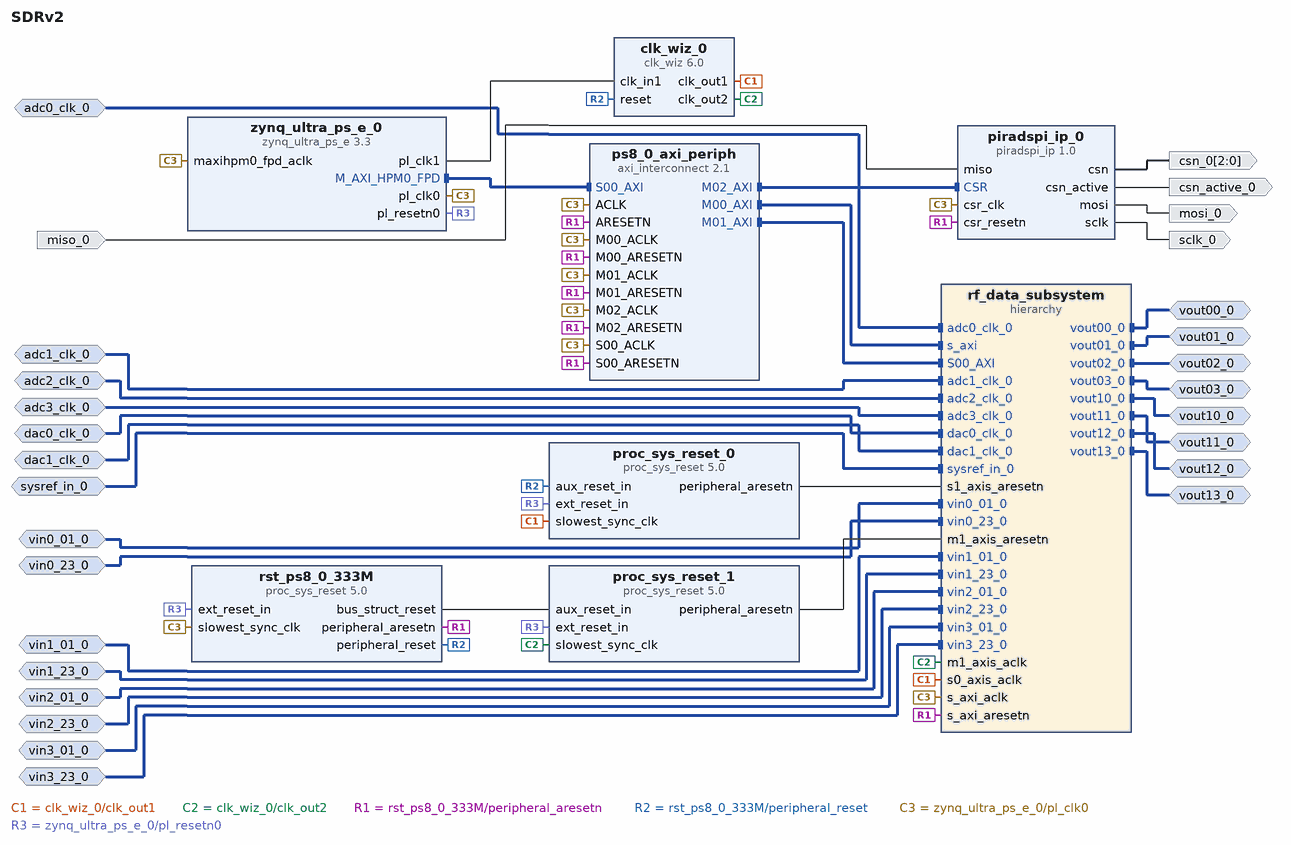
[diagram p0: block diagram of the top level]
# Vivado block design SDRv2, xczu28dr-ffvg1517-2-e, Vivado 2021.2
create_bd_design SDRv2

create_bd_intf_port -mode Slave -vlnv xilinx.com:interface:diff_clock_rtl:1.0 adc0_clk_0
create_bd_intf_port -mode Slave -vlnv xilinx.com:interface:diff_clock_rtl:1.0 adc1_clk_0
create_bd_intf_port -mode Slave -vlnv xilinx.com:interface:diff_clock_rtl:1.0 adc2_clk_0
create_bd_intf_port -mode Slave -vlnv xilinx.com:interface:diff_clock_rtl:1.0 adc3_clk_0
create_bd_intf_port -mode Slave -vlnv xilinx.com:interface:diff_clock_rtl:1.0 dac0_clk_0
create_bd_intf_port -mode Slave -vlnv xilinx.com:interface:diff_clock_rtl:1.0 dac1_clk_0
create_bd_intf_port -mode Slave -vlnv xilinx.com:display_usp_rf_data_converter:diff_pins_rtl:1.0 sysref_in_0
create_bd_intf_port -mode Slave -vlnv xilinx.com:interface:diff_analog_io_rtl:1.0 vin0_01_0
create_bd_intf_port -mode Slave -vlnv xilinx.com:interface:diff_analog_io_rtl:1.0 vin0_23_0
create_bd_intf_port -mode Slave -vlnv xilinx.com:interface:diff_analog_io_rtl:1.0 vin1_01_0
create_bd_intf_port -mode Slave -vlnv xilinx.com:interface:diff_analog_io_rtl:1.0 vin1_23_0
create_bd_intf_port -mode Slave -vlnv xilinx.com:interface:diff_analog_io_rtl:1.0 vin2_01_0
create_bd_intf_port -mode Slave -vlnv xilinx.com:interface:diff_analog_io_rtl:1.0 vin2_23_0
create_bd_intf_port -mode Slave -vlnv xilinx.com:interface:diff_analog_io_rtl:1.0 vin3_01_0
create_bd_intf_port -mode Slave -vlnv xilinx.com:interface:diff_analog_io_rtl:1.0 vin3_23_0
create_bd_intf_port -mode Master -vlnv xilinx.com:interface:diff_analog_io_rtl:1.0 vout00_0
create_bd_intf_port -mode Master -vlnv xilinx.com:interface:diff_analog_io_rtl:1.0 vout01_0
create_bd_intf_port -mode Master -vlnv xilinx.com:interface:diff_analog_io_rtl:1.0 vout02_0
create_bd_intf_port -mode Master -vlnv xilinx.com:interface:diff_analog_io_rtl:1.0 vout03_0
create_bd_intf_port -mode Master -vlnv xilinx.com:interface:diff_analog_io_rtl:1.0 vout10_0
create_bd_intf_port -mode Master -vlnv xilinx.com:interface:diff_analog_io_rtl:1.0 vout11_0
create_bd_intf_port -mode Master -vlnv xilinx.com:interface:diff_analog_io_rtl:1.0 vout12_0
create_bd_intf_port -mode Master -vlnv xilinx.com:interface:diff_analog_io_rtl:1.0 vout13_0
create_bd_port -dir O -from 2 -to 0 csn_0
create_bd_port -dir O csn_active_0
create_bd_port -dir I miso_0
create_bd_port -dir O mosi_0
create_bd_port -dir O sclk_0

create_bd_cell -type ip -vlnv xilinx.com:ip:clk_wiz:6.0 clk_wiz_0
set_property -dict [list \
  CONFIG.CLKOUT1_JITTER 75.993 \
  CONFIG.CLKOUT1_PHASE_ERROR 79.886 \
  CONFIG.CLKOUT1_REQUESTED_OUT_FREQ 400 \
  CONFIG.CLKOUT2_JITTER 72.701 \
  CONFIG.CLKOUT2_PHASE_ERROR 79.886 \
  CONFIG.CLKOUT2_REQUESTED_OUT_FREQ 500 \
  CONFIG.CLKOUT2_USED true \
  CONFIG.MMCM_CLKFBOUT_MULT_F 2.000 \
  CONFIG.MMCM_CLKOUT0_DIVIDE_F 2.500 \
  CONFIG.MMCM_CLKOUT1_DIVIDE 2 \
  CONFIG.NUM_OUT_CLKS 2 \
  CONFIG.RESET_BOARD_INTERFACE reset \
  CONFIG.USE_BOARD_FLOW true \
] [get_bd_cells clk_wiz_0]
create_bd_cell -type ip -vlnv pi-rad.io:piradip:piradspi_ip:1.0 piradspi_ip_0
create_bd_cell -type ip -vlnv xilinx.com:ip:proc_sys_reset:5.0 proc_sys_reset_0
create_bd_cell -type ip -vlnv xilinx.com:ip:proc_sys_reset:5.0 proc_sys_reset_1
create_bd_cell -type ip -vlnv xilinx.com:ip:axi_interconnect:2.1 ps8_0_axi_periph
set_property -dict {CONFIG.ENABLE_ADVANCED_OPTIONS 1 CONFIG.NUM_MI 3} [get_bd_cells ps8_0_axi_periph]
create_bd_cell -type hier rf_data_subsystem
create_bd_cell -type ip -vlnv xilinx.com:ip:proc_sys_reset:5.0 rst_ps8_0_333M
create_bd_cell -type ip -vlnv xilinx.com:ip:zynq_ultra_ps_e:3.3 zynq_ultra_ps_e_0
set_property -dict [list \
  CONFIG.PSU_BANK_0_IO_STANDARD LVCMOS18 \
  CONFIG.PSU_BANK_1_IO_STANDARD LVCMOS18 \
  CONFIG.PSU_BANK_2_IO_STANDARD LVCMOS18 \
  CONFIG.PSU_DYNAMIC_DDR_CONFIG_EN 1 \
  CONFIG.PSU_USB3__DUAL_CLOCK_ENABLE 1 \
  CONFIG.PSU__CAN1__PERIPHERAL__ENABLE 0 \
  CONFIG.PSU__CRF_APB__ACPU_CTRL__FREQMHZ 1200 \
  CONFIG.PSU__CRF_APB__ACPU_CTRL__SRCSEL APLL \
  CONFIG.PSU__CRF_APB__APLL_CTRL__SRCSEL PSS_REF_CLK \
  CONFIG.PSU__CRF_APB__DBG_FPD_CTRL__FREQMHZ 250 \
  CONFIG.PSU__CRF_APB__DBG_FPD_CTRL__SRCSEL IOPLL \
  CONFIG.PSU__CRF_APB__DBG_TRACE_CTRL__FREQMHZ 250 \
  CONFIG.PSU__CRF_APB__DBG_TRACE_CTRL__SRCSEL IOPLL \
  CONFIG.PSU__CRF_APB__DBG_TSTMP_CTRL__FREQMHZ 250 \
  CONFIG.PSU__CRF_APB__DBG_TSTMP_CTRL__SRCSEL IOPLL \
  CONFIG.PSU__CRF_APB__DDR_CTRL__FREQMHZ 1067 \
  CONFIG.PSU__CRF_APB__DDR_CTRL__SRCSEL DPLL \
  CONFIG.PSU__CRF_APB__DPDMA_REF_CTRL__FREQMHZ 600 \
  CONFIG.PSU__CRF_APB__DPDMA_REF_CTRL__SRCSEL APLL \
  CONFIG.PSU__CRF_APB__DPLL_CTRL__SRCSEL PSS_REF_CLK \
  CONFIG.PSU__CRF_APB__DP_AUDIO_REF_CTRL__SRCSEL RPLL \
  CONFIG.PSU__CRF_APB__DP_STC_REF_CTRL__SRCSEL RPLL \
  CONFIG.PSU__CRF_APB__DP_VIDEO_REF_CTRL__SRCSEL VPLL \
  CONFIG.PSU__CRF_APB__GDMA_REF_CTRL__FREQMHZ 600 \
  CONFIG.PSU__CRF_APB__GDMA_REF_CTRL__SRCSEL APLL \
  CONFIG.PSU__CRF_APB__GPU_REF_CTRL__FREQMHZ 500 \
  CONFIG.PSU__CRF_APB__GPU_REF_CTRL__SRCSEL IOPLL \
  CONFIG.PSU__CRF_APB__TOPSW_LSBUS_CTRL__FREQMHZ 100 \
  CONFIG.PSU__CRF_APB__TOPSW_LSBUS_CTRL__SRCSEL IOPLL \
  CONFIG.PSU__CRF_APB__TOPSW_MAIN_CTRL__FREQMHZ 533.33 \
  CONFIG.PSU__CRF_APB__TOPSW_MAIN_CTRL__SRCSEL DPLL \
  CONFIG.PSU__CRF_APB__VPLL_CTRL__SRCSEL PSS_REF_CLK \
  CONFIG.PSU__CRL_APB__ADMA_REF_CTRL__FREQMHZ 500 \
  CONFIG.PSU__CRL_APB__ADMA_REF_CTRL__SRCSEL IOPLL \
  CONFIG.PSU__CRL_APB__CAN1_REF_CTRL__FREQMHZ 100 \
  CONFIG.PSU__CRL_APB__CAN1_REF_CTRL__SRCSEL IOPLL \
  CONFIG.PSU__CRL_APB__CPU_R5_CTRL__FREQMHZ 500 \
  CONFIG.PSU__CRL_APB__CPU_R5_CTRL__SRCSEL IOPLL \
  CONFIG.PSU__CRL_APB__DBG_LPD_CTRL__FREQMHZ 250 \
  CONFIG.PSU__CRL_APB__DBG_LPD_CTRL__SRCSEL IOPLL \
  CONFIG.PSU__CRL_APB__GEM3_REF_CTRL__FREQMHZ 125 \
  CONFIG.PSU__CRL_APB__GEM3_REF_CTRL__SRCSEL IOPLL \
  CONFIG.PSU__CRL_APB__I2C0_REF_CTRL__FREQMHZ 100 \
  CONFIG.PSU__CRL_APB__I2C0_REF_CTRL__SRCSEL IOPLL \
  CONFIG.PSU__CRL_APB__I2C1_REF_CTRL__FREQMHZ 100 \
  CONFIG.PSU__CRL_APB__I2C1_REF_CTRL__SRCSEL IOPLL \
  CONFIG.PSU__CRL_APB__IOPLL_CTRL__SRCSEL PSS_REF_CLK \
  CONFIG.PSU__CRL_APB__IOU_SWITCH_CTRL__FREQMHZ 250 \
  CONFIG.PSU__CRL_APB__IOU_SWITCH_CTRL__SRCSEL IOPLL \
  CONFIG.PSU__CRL_APB__LPD_LSBUS_CTRL__FREQMHZ 100 \
  CONFIG.PSU__CRL_APB__LPD_LSBUS_CTRL__SRCSEL IOPLL \
  CONFIG.PSU__CRL_APB__LPD_SWITCH_CTRL__FREQMHZ 500 \
  CONFIG.PSU__CRL_APB__LPD_SWITCH_CTRL__SRCSEL IOPLL \
  CONFIG.PSU__CRL_APB__PCAP_CTRL__FREQMHZ 200 \
  CONFIG.PSU__CRL_APB__PCAP_CTRL__SRCSEL IOPLL \
  CONFIG.PSU__CRL_APB__PL0_REF_CTRL__FREQMHZ 333.333 \
  CONFIG.PSU__CRL_APB__PL0_REF_CTRL__SRCSEL RPLL \
  CONFIG.PSU__CRL_APB__PL1_REF_CTRL__FREQMHZ 500 \
  CONFIG.PSU__CRL_APB__QSPI_REF_CTRL__FREQMHZ 125 \
  CONFIG.PSU__CRL_APB__QSPI_REF_CTRL__SRCSEL IOPLL \
  CONFIG.PSU__CRL_APB__RPLL_CTRL__SRCSEL PSS_REF_CLK \
  CONFIG.PSU__CRL_APB__SDIO1_REF_CTRL__FREQMHZ 200 \
  CONFIG.PSU__CRL_APB__SDIO1_REF_CTRL__SRCSEL IOPLL \
  CONFIG.PSU__CRL_APB__TIMESTAMP_REF_CTRL__FREQMHZ 100 \
  CONFIG.PSU__CRL_APB__TIMESTAMP_REF_CTRL__SRCSEL IOPLL \
  CONFIG.PSU__CRL_APB__UART0_REF_CTRL__FREQMHZ 100 \
  CONFIG.PSU__CRL_APB__UART0_REF_CTRL__SRCSEL IOPLL \
  CONFIG.PSU__CRL_APB__UART1_REF_CTRL__FREQMHZ 100 \
  CONFIG.PSU__CRL_APB__UART1_REF_CTRL__SRCSEL IOPLL \
  CONFIG.PSU__CRL_APB__USB0_BUS_REF_CTRL__FREQMHZ 250 \
  CONFIG.PSU__CRL_APB__USB0_BUS_REF_CTRL__SRCSEL IOPLL \
  CONFIG.PSU__CRL_APB__USB3_DUAL_REF_CTRL__FREQMHZ 20 \
  CONFIG.PSU__CRL_APB__USB3_DUAL_REF_CTRL__SRCSEL IOPLL \
  CONFIG.PSU__CRL_APB__USB3__ENABLE 1 \
  CONFIG.PSU__CSUPMU__PERIPHERAL__VALID 1 \
  CONFIG.PSU__DDRC__BUS_WIDTH {64 Bit} \
  CONFIG.PSU__DDRC__COMPONENTS UDIMM \
  CONFIG.PSU__DDRC__DEVICE_CAPACITY {8192 MBits} \
  CONFIG.PSU__DDRC__DRAM_WIDTH {16 Bits} \
  CONFIG.PSU__DDRC__ECC Disabled \
  CONFIG.PSU__DDRC__MEMORY_TYPE {DDR 4} \
  CONFIG.PSU__DDRC__SPEED_BIN DDR4_2133P \
  CONFIG.PSU__DDR_HIGH_ADDRESS_GUI_ENABLE 1 \
  CONFIG.PSU__DDR__INTERFACE__FREQMHZ 533.500 \
  CONFIG.PSU__DISPLAYPORT__LANE0__ENABLE 1 \
  CONFIG.PSU__DISPLAYPORT__LANE0__IO {GT Lane1} \
  CONFIG.PSU__DISPLAYPORT__LANE1__ENABLE 1 \
  CONFIG.PSU__DISPLAYPORT__LANE1__IO {GT Lane0} \
  CONFIG.PSU__DISPLAYPORT__PERIPHERAL__ENABLE 1 \
  CONFIG.PSU__DLL__ISUSED 1 \
  CONFIG.PSU__DPAUX__PERIPHERAL__ENABLE 1 \
  CONFIG.PSU__DPAUX__PERIPHERAL__IO {MIO 27 .. 30} \
  CONFIG.PSU__DP__LANE_SEL {Dual Lower} \
  CONFIG.PSU__DP__REF_CLK_FREQ 27 \
  CONFIG.PSU__DP__REF_CLK_SEL {Ref Clk1} \
  CONFIG.PSU__ENET3__FIFO__ENABLE 0 \
  CONFIG.PSU__ENET3__GRP_MDIO__ENABLE 1 \
  CONFIG.PSU__ENET3__GRP_MDIO__IO {MIO 76 .. 77} \
  CONFIG.PSU__ENET3__PERIPHERAL__ENABLE 1 \
  CONFIG.PSU__ENET3__PERIPHERAL__IO {MIO 64 .. 75} \
  CONFIG.PSU__ENET3__PTP__ENABLE 0 \
  CONFIG.PSU__ENET3__TSU__ENABLE 0 \
  CONFIG.PSU__FPGA_PL0_ENABLE 1 \
  CONFIG.PSU__FPGA_PL1_ENABLE 1 \
  CONFIG.PSU__GEM3_COHERENCY 0 \
  CONFIG.PSU__GEM3_ROUTE_THROUGH_FPD 0 \
  CONFIG.PSU__GEM__TSU__ENABLE 0 \
  CONFIG.PSU__GPIO0_MIO__IO {MIO 0 .. 25} \
  CONFIG.PSU__GPIO0_MIO__PERIPHERAL__ENABLE 1 \
  CONFIG.PSU__GPIO1_MIO__IO {MIO 26 .. 51} \
  CONFIG.PSU__GPIO1_MIO__PERIPHERAL__ENABLE 1 \
  CONFIG.PSU__GT__LINK_SPEED HBR \
  CONFIG.PSU__GT__PRE_EMPH_LVL_4 0 \
  CONFIG.PSU__GT__VLT_SWNG_LVL_4 0 \
  CONFIG.PSU__I2C0__PERIPHERAL__ENABLE 1 \
  CONFIG.PSU__I2C0__PERIPHERAL__IO {MIO 14 .. 15} \
  CONFIG.PSU__I2C1__PERIPHERAL__ENABLE 1 \
  CONFIG.PSU__I2C1__PERIPHERAL__IO {MIO 16 .. 17} \
  CONFIG.PSU__IOU_SLCR__IOU_TTC_APB_CLK__TTC0_SEL APB \
  CONFIG.PSU__IOU_SLCR__IOU_TTC_APB_CLK__TTC1_SEL APB \
  CONFIG.PSU__IOU_SLCR__IOU_TTC_APB_CLK__TTC2_SEL APB \
  CONFIG.PSU__IOU_SLCR__IOU_TTC_APB_CLK__TTC3_SEL APB \
  CONFIG.PSU__MAXIGP0__DATA_WIDTH 128 \
  CONFIG.PSU__OVERRIDE__BASIC_CLOCK 0 \
  CONFIG.PSU__PMU_COHERENCY 0 \
  CONFIG.PSU__PMU__AIBACK__ENABLE 0 \
  CONFIG.PSU__PMU__EMIO_GPI__ENABLE 0 \
  CONFIG.PSU__PMU__EMIO_GPO__ENABLE 0 \
  CONFIG.PSU__PMU__GPI0__ENABLE 0 \
  CONFIG.PSU__PMU__GPI1__ENABLE 0 \
  CONFIG.PSU__PMU__GPI2__ENABLE 0 \
  CONFIG.PSU__PMU__GPI3__ENABLE 0 \
  CONFIG.PSU__PMU__GPI4__ENABLE 0 \
  CONFIG.PSU__PMU__GPI5__ENABLE 0 \
  CONFIG.PSU__PMU__GPO0__ENABLE 1 \
  CONFIG.PSU__PMU__GPO0__IO {MIO 32} \
  CONFIG.PSU__PMU__GPO1__ENABLE 1 \
  CONFIG.PSU__PMU__GPO1__IO {MIO 33} \
  CONFIG.PSU__PMU__GPO2__ENABLE 1 \
  CONFIG.PSU__PMU__GPO2__IO {MIO 34} \
  CONFIG.PSU__PMU__GPO2__POLARITY low \
  CONFIG.PSU__PMU__GPO3__ENABLE 1 \
  CONFIG.PSU__PMU__GPO3__IO {MIO 35} \
  CONFIG.PSU__PMU__GPO3__POLARITY low \
  CONFIG.PSU__PMU__GPO4__ENABLE 1 \
  CONFIG.PSU__PMU__GPO4__IO {MIO 36} \
  CONFIG.PSU__PMU__GPO4__POLARITY low \
  CONFIG.PSU__PMU__GPO5__ENABLE 1 \
  CONFIG.PSU__PMU__GPO5__IO {MIO 37} \
  CONFIG.PSU__PMU__GPO5__POLARITY low \
  CONFIG.PSU__PMU__PERIPHERAL__ENABLE 1 \
  CONFIG.PSU__PMU__PLERROR__ENABLE 0 \
  CONFIG.PSU__PRESET_APPLIED 1 \
  CONFIG.PSU__PSS_REF_CLK__FREQMHZ 33.333 \
  CONFIG.PSU__QSPI_COHERENCY 0 \
  CONFIG.PSU__QSPI_ROUTE_THROUGH_FPD 0 \
  CONFIG.PSU__QSPI__GRP_FBCLK__ENABLE 1 \
  CONFIG.PSU__QSPI__GRP_FBCLK__IO {MIO 6} \
  CONFIG.PSU__QSPI__PERIPHERAL__DATA_MODE x4 \
  CONFIG.PSU__QSPI__PERIPHERAL__ENABLE 1 \
  CONFIG.PSU__QSPI__PERIPHERAL__IO {MIO 0 .. 12} \
  CONFIG.PSU__QSPI__PERIPHERAL__MODE {Dual Parallel} \
  CONFIG.PSU__SATA__LANE1__IO {GT Lane3} \
  CONFIG.PSU__SATA__PERIPHERAL__ENABLE 1 \
  CONFIG.PSU__SATA__REF_CLK_FREQ 125 \
  CONFIG.PSU__SATA__REF_CLK_SEL {Ref Clk3} \
  CONFIG.PSU__SD1_COHERENCY 0 \
  CONFIG.PSU__SD1_ROUTE_THROUGH_FPD 0 \
  CONFIG.PSU__SD1__DATA_TRANSFER_MODE 8Bit \
  CONFIG.PSU__SD1__GRP_CD__ENABLE 1 \
  CONFIG.PSU__SD1__GRP_CD__IO {MIO 45} \
  CONFIG.PSU__SD1__GRP_POW__ENABLE 0 \
  CONFIG.PSU__SD1__GRP_WP__ENABLE 0 \
  CONFIG.PSU__SD1__PERIPHERAL__ENABLE 1 \
  CONFIG.PSU__SD1__PERIPHERAL__IO {MIO 39 .. 51} \
  CONFIG.PSU__SD1__SLOT_TYPE {SD 3.0} \
  CONFIG.PSU__SWDT0__CLOCK__ENABLE 0 \
  CONFIG.PSU__SWDT0__PERIPHERAL__ENABLE 1 \
  CONFIG.PSU__SWDT0__RESET__ENABLE 0 \
  CONFIG.PSU__SWDT1__CLOCK__ENABLE 0 \
  CONFIG.PSU__SWDT1__PERIPHERAL__ENABLE 1 \
  CONFIG.PSU__SWDT1__RESET__ENABLE 0 \
  CONFIG.PSU__TSU__BUFG_PORT_PAIR 0 \
  CONFIG.PSU__TTC0__CLOCK__ENABLE 0 \
  CONFIG.PSU__TTC0__PERIPHERAL__ENABLE 1 \
  CONFIG.PSU__TTC0__WAVEOUT__ENABLE 0 \
  CONFIG.PSU__TTC1__CLOCK__ENABLE 0 \
  CONFIG.PSU__TTC1__PERIPHERAL__ENABLE 1 \
  CONFIG.PSU__TTC1__WAVEOUT__ENABLE 0 \
  CONFIG.PSU__TTC2__CLOCK__ENABLE 0 \
  CONFIG.PSU__TTC2__PERIPHERAL__ENABLE 1 \
  CONFIG.PSU__TTC2__WAVEOUT__ENABLE 0 \
  CONFIG.PSU__TTC3__CLOCK__ENABLE 0 \
  CONFIG.PSU__TTC3__PERIPHERAL__ENABLE 1 \
  CONFIG.PSU__TTC3__WAVEOUT__ENABLE 0 \
  CONFIG.PSU__UART0__BAUD_RATE 115200 \
  CONFIG.PSU__UART0__MODEM__ENABLE 0 \
  CONFIG.PSU__UART0__PERIPHERAL__ENABLE 1 \
  CONFIG.PSU__UART0__PERIPHERAL__IO {MIO 18 .. 19} \
  CONFIG.PSU__UART1__BAUD_RATE 115200 \
  CONFIG.PSU__UART1__MODEM__ENABLE 0 \
  CONFIG.PSU__UART1__PERIPHERAL__ENABLE 1 \
  CONFIG.PSU__UART1__PERIPHERAL__IO EMIO \
  CONFIG.PSU__USB0_COHERENCY 0 \
  CONFIG.PSU__USB0__PERIPHERAL__ENABLE 1 \
  CONFIG.PSU__USB0__PERIPHERAL__IO {MIO 52 .. 63} \
  CONFIG.PSU__USB0__REF_CLK_FREQ 26 \
  CONFIG.PSU__USB0__REF_CLK_SEL {Ref Clk2} \
  CONFIG.PSU__USB2_0__EMIO__ENABLE 0 \
  CONFIG.PSU__USB3_0__EMIO__ENABLE 0 \
  CONFIG.PSU__USB3_0__PERIPHERAL__ENABLE 1 \
  CONFIG.PSU__USB3_0__PERIPHERAL__IO {GT Lane2} \
  CONFIG.PSU__USB__RESET__MODE {Boot Pin} \
  CONFIG.PSU__USB__RESET__POLARITY {Active Low} \
  CONFIG.PSU__USE__IRQ0 1 \
  CONFIG.PSU__USE__M_AXI_GP0 1 \
  CONFIG.PSU__USE__M_AXI_GP1 0 \
  CONFIG.PSU__USE__M_AXI_GP2 0 \
] [get_bd_cells zynq_ultra_ps_e_0]
# 102 more settings of zynq_ultra_ps_e_0 are not shown: defaults, MIO pin electricals, DDR timing, and values the tool derives

# ---- hierarchy /rf_data_subsystem ----
current_bd_instance /rf_data_subsystem
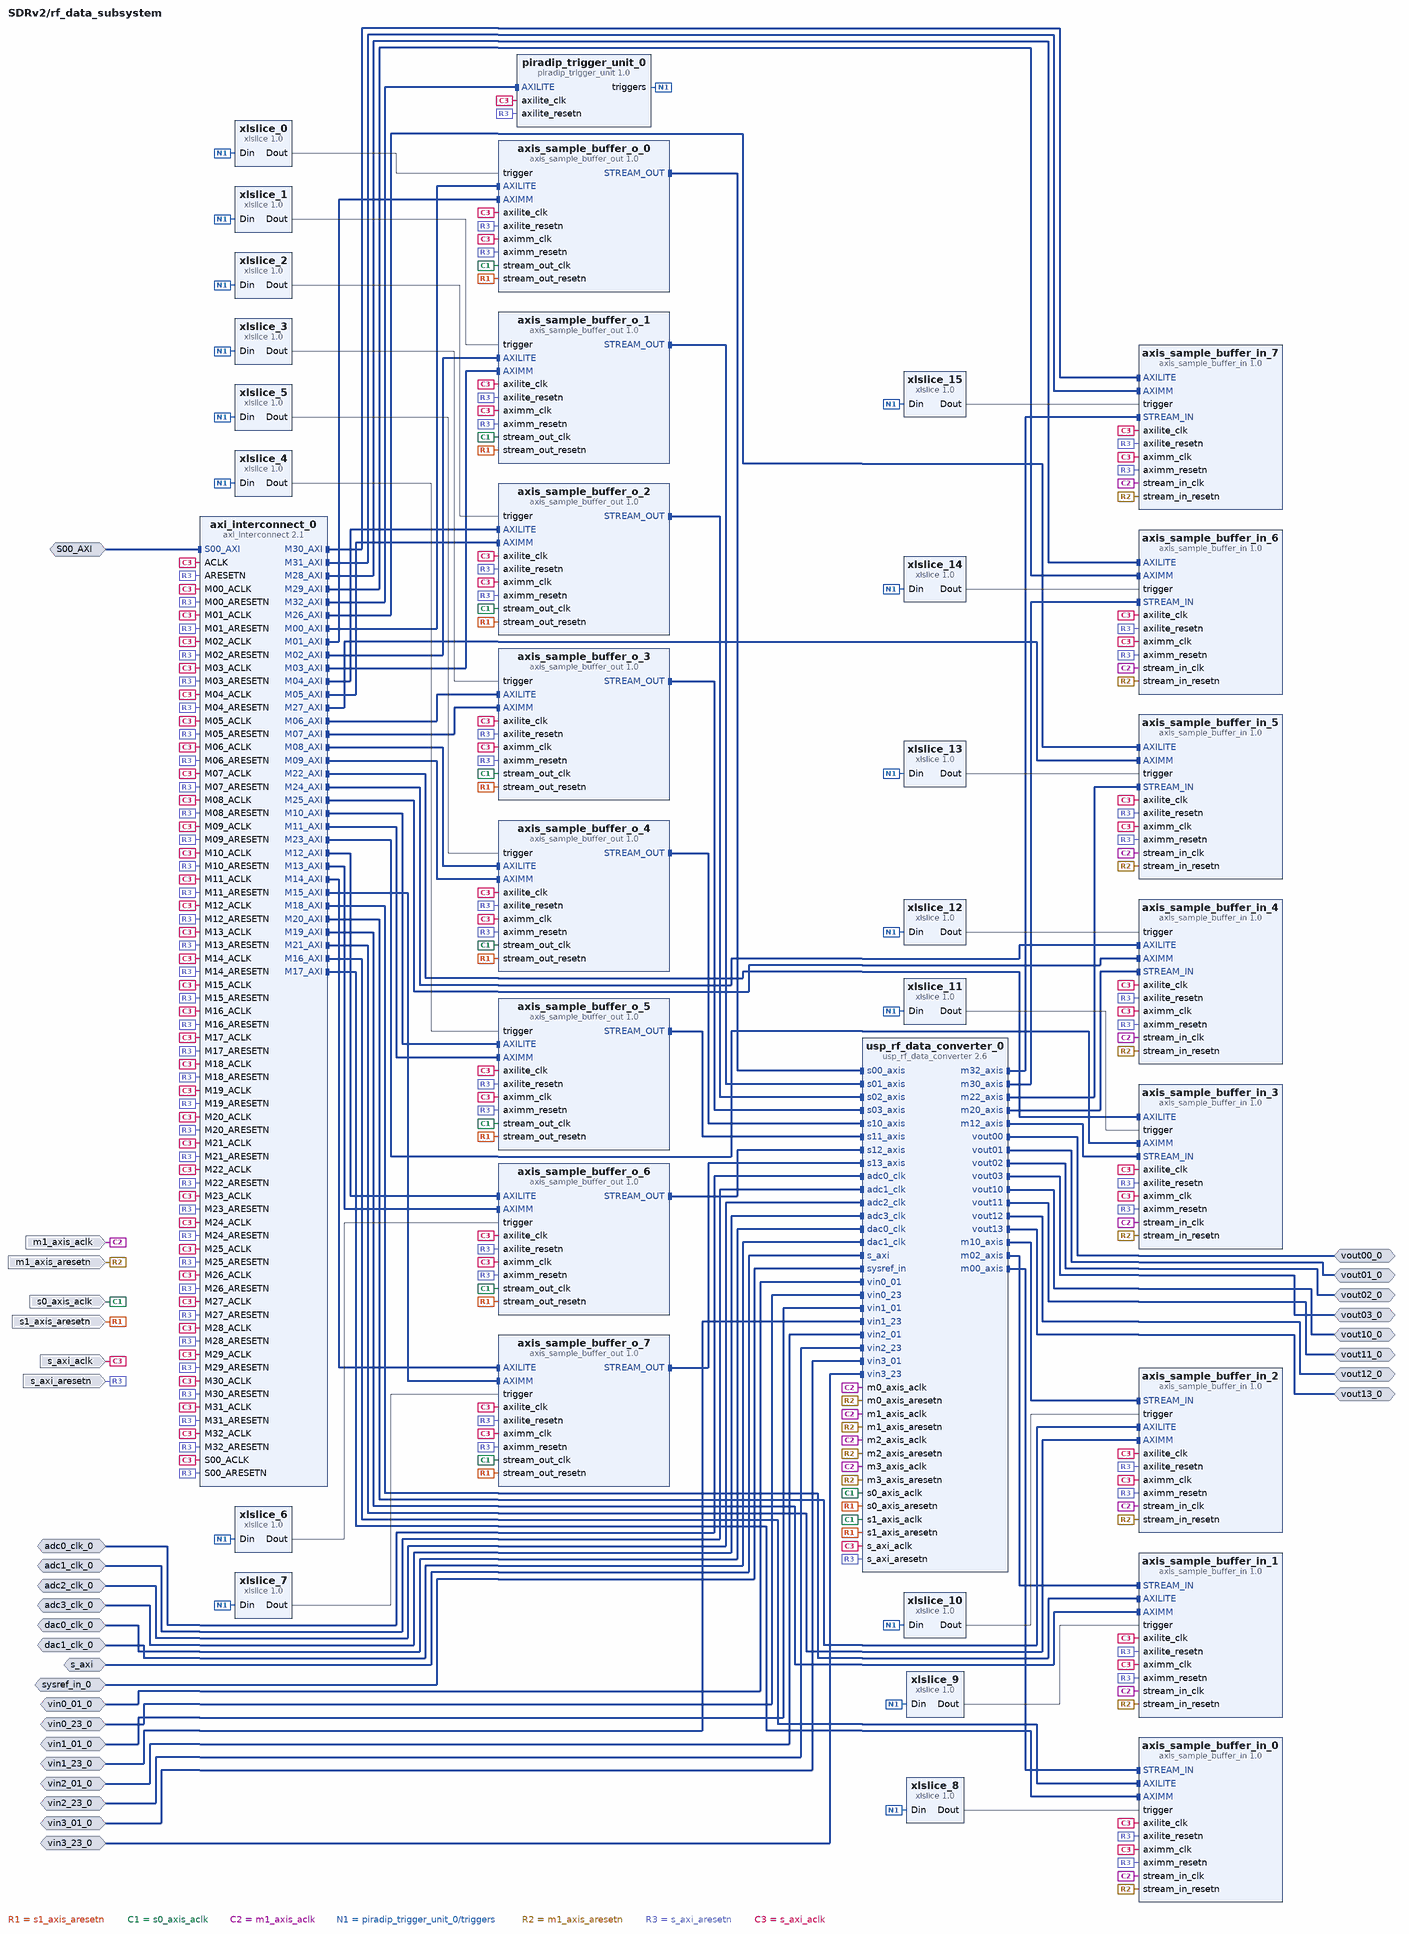
[diagram p1: block diagram inside /rf_data_subsystem]
create_bd_intf_pin -mode Slave -vlnv xilinx.com:interface:aximm_rtl:1.0 S00_AXI
create_bd_intf_pin -mode Slave -vlnv xilinx.com:interface:diff_clock_rtl:1.0 adc0_clk_0
create_bd_intf_pin -mode Slave -vlnv xilinx.com:interface:diff_clock_rtl:1.0 adc1_clk_0
create_bd_intf_pin -mode Slave -vlnv xilinx.com:interface:diff_clock_rtl:1.0 adc2_clk_0
create_bd_intf_pin -mode Slave -vlnv xilinx.com:interface:diff_clock_rtl:1.0 adc3_clk_0
create_bd_intf_pin -mode Slave -vlnv xilinx.com:interface:diff_clock_rtl:1.0 dac0_clk_0
create_bd_intf_pin -mode Slave -vlnv xilinx.com:interface:diff_clock_rtl:1.0 dac1_clk_0
create_bd_intf_pin -mode Slave -vlnv xilinx.com:interface:aximm_rtl:1.0 s_axi
create_bd_intf_pin -mode Slave -vlnv xilinx.com:display_usp_rf_data_converter:diff_pins_rtl:1.0 sysref_in_0
create_bd_intf_pin -mode Slave -vlnv xilinx.com:interface:diff_analog_io_rtl:1.0 vin0_01_0
create_bd_intf_pin -mode Slave -vlnv xilinx.com:interface:diff_analog_io_rtl:1.0 vin0_23_0
create_bd_intf_pin -mode Slave -vlnv xilinx.com:interface:diff_analog_io_rtl:1.0 vin1_01_0
create_bd_intf_pin -mode Slave -vlnv xilinx.com:interface:diff_analog_io_rtl:1.0 vin1_23_0
create_bd_intf_pin -mode Slave -vlnv xilinx.com:interface:diff_analog_io_rtl:1.0 vin2_01_0
create_bd_intf_pin -mode Slave -vlnv xilinx.com:interface:diff_analog_io_rtl:1.0 vin2_23_0
create_bd_intf_pin -mode Slave -vlnv xilinx.com:interface:diff_analog_io_rtl:1.0 vin3_01_0
create_bd_intf_pin -mode Slave -vlnv xilinx.com:interface:diff_analog_io_rtl:1.0 vin3_23_0
create_bd_intf_pin -mode Master -vlnv xilinx.com:interface:diff_analog_io_rtl:1.0 vout00_0
create_bd_intf_pin -mode Master -vlnv xilinx.com:interface:diff_analog_io_rtl:1.0 vout01_0
create_bd_intf_pin -mode Master -vlnv xilinx.com:interface:diff_analog_io_rtl:1.0 vout02_0
create_bd_intf_pin -mode Master -vlnv xilinx.com:interface:diff_analog_io_rtl:1.0 vout03_0
create_bd_intf_pin -mode Master -vlnv xilinx.com:interface:diff_analog_io_rtl:1.0 vout10_0
create_bd_intf_pin -mode Master -vlnv xilinx.com:interface:diff_analog_io_rtl:1.0 vout11_0
create_bd_intf_pin -mode Master -vlnv xilinx.com:interface:diff_analog_io_rtl:1.0 vout12_0
create_bd_intf_pin -mode Master -vlnv xilinx.com:interface:diff_analog_io_rtl:1.0 vout13_0
create_bd_pin -dir I -type clk m1_axis_aclk
create_bd_pin -dir I -type rst m1_axis_aresetn
create_bd_pin -dir I -type clk s0_axis_aclk
create_bd_pin -dir I -type rst s1_axis_aresetn
create_bd_pin -dir I -type clk s_axi_aclk
create_bd_pin -dir I -type rst s_axi_aresetn

create_bd_cell -type ip -vlnv xilinx.com:ip:axi_interconnect:2.1 axi_interconnect_0
set_property -dict {CONFIG.ENABLE_ADVANCED_OPTIONS 0 CONFIG.NUM_MI 33} [get_bd_cells axi_interconnect_0]
create_bd_cell -type ip -vlnv pi-rad.io:piradip:axis_sample_buffer_out:1.0 axis_sample_buffer_o_0
set_property -dict {CONFIG.C_AXIMM_ADDR_WIDTH 15 CONFIG.STREAM_OUT_WIDTH 256} [get_bd_cells axis_sample_buffer_o_0]
create_bd_cell -type ip -vlnv pi-rad.io:piradip:axis_sample_buffer_out:1.0 axis_sample_buffer_o_1
set_property -dict {CONFIG.C_AXIMM_ADDR_WIDTH 15 CONFIG.STREAM_OUT_WIDTH 256} [get_bd_cells axis_sample_buffer_o_1]
create_bd_cell -type ip -vlnv pi-rad.io:piradip:axis_sample_buffer_out:1.0 axis_sample_buffer_o_2
set_property -dict {CONFIG.C_AXIMM_ADDR_WIDTH 15 CONFIG.STREAM_OUT_WIDTH 256} [get_bd_cells axis_sample_buffer_o_2]
create_bd_cell -type ip -vlnv pi-rad.io:piradip:axis_sample_buffer_out:1.0 axis_sample_buffer_o_3
set_property -dict {CONFIG.C_AXIMM_ADDR_WIDTH 15 CONFIG.STREAM_OUT_WIDTH 256} [get_bd_cells axis_sample_buffer_o_3]
create_bd_cell -type ip -vlnv pi-rad.io:piradip:axis_sample_buffer_out:1.0 axis_sample_buffer_o_4
set_property -dict {CONFIG.C_AXIMM_ADDR_WIDTH 15 CONFIG.STREAM_OUT_WIDTH 256} [get_bd_cells axis_sample_buffer_o_4]
create_bd_cell -type ip -vlnv pi-rad.io:piradip:axis_sample_buffer_out:1.0 axis_sample_buffer_o_5
set_property -dict {CONFIG.C_AXIMM_ADDR_WIDTH 15 CONFIG.STREAM_OUT_WIDTH 256} [get_bd_cells axis_sample_buffer_o_5]
create_bd_cell -type ip -vlnv pi-rad.io:piradip:axis_sample_buffer_out:1.0 axis_sample_buffer_o_6
set_property -dict {CONFIG.C_AXIMM_ADDR_WIDTH 15 CONFIG.STREAM_OUT_WIDTH 256} [get_bd_cells axis_sample_buffer_o_6]
create_bd_cell -type ip -vlnv pi-rad.io:piradip:axis_sample_buffer_out:1.0 axis_sample_buffer_o_7
set_property -dict {CONFIG.C_AXIMM_ADDR_WIDTH 15 CONFIG.STREAM_OUT_WIDTH 256} [get_bd_cells axis_sample_buffer_o_7]
create_bd_cell -type ip -vlnv xilinx.com:ip:usp_rf_data_converter:2.6 usp_rf_data_converter_0
set_property -dict [list \
  CONFIG.ADC0_Outclk_Freq 31.250 \
  CONFIG.ADC0_Refclk_Freq 4000.000 \
  CONFIG.ADC0_Sampling_Rate 4.0 \
  CONFIG.ADC1_Outclk_Freq 31.250 \
  CONFIG.ADC1_Refclk_Freq 4000.000 \
  CONFIG.ADC1_Sampling_Rate 4.0 \
  CONFIG.ADC2_Outclk_Freq 31.250 \
  CONFIG.ADC2_Refclk_Freq 4000.000 \
  CONFIG.ADC2_Sampling_Rate 4.0 \
  CONFIG.ADC3_Outclk_Freq 31.250 \
  CONFIG.ADC3_Refclk_Freq 4000.000 \
  CONFIG.ADC3_Sampling_Rate 4.0 \
  CONFIG.ADC_Decimation_Mode02 1 \
  CONFIG.ADC_Decimation_Mode10 1 \
  CONFIG.ADC_Decimation_Mode12 1 \
  CONFIG.ADC_Decimation_Mode20 1 \
  CONFIG.ADC_Decimation_Mode22 1 \
  CONFIG.ADC_Decimation_Mode30 1 \
  CONFIG.ADC_Decimation_Mode32 1 \
  CONFIG.ADC_Mixer_Type02 0 \
  CONFIG.ADC_Mixer_Type03 0 \
  CONFIG.ADC_Mixer_Type10 0 \
  CONFIG.ADC_Mixer_Type11 0 \
  CONFIG.ADC_Mixer_Type12 0 \
  CONFIG.ADC_Mixer_Type13 0 \
  CONFIG.ADC_Mixer_Type20 0 \
  CONFIG.ADC_Mixer_Type21 0 \
  CONFIG.ADC_Mixer_Type22 0 \
  CONFIG.ADC_Mixer_Type23 0 \
  CONFIG.ADC_Mixer_Type30 0 \
  CONFIG.ADC_Mixer_Type31 0 \
  CONFIG.ADC_Mixer_Type32 0 \
  CONFIG.ADC_Mixer_Type33 0 \
  CONFIG.ADC_Slice02_Enable true \
  CONFIG.ADC_Slice10_Enable true \
  CONFIG.ADC_Slice12_Enable true \
  CONFIG.ADC_Slice20_Enable true \
  CONFIG.ADC_Slice22_Enable true \
  CONFIG.ADC_Slice30_Enable true \
  CONFIG.ADC_Slice32_Enable true \
  CONFIG.DAC_Interpolation_Mode00 1 \
  CONFIG.DAC_Interpolation_Mode01 1 \
  CONFIG.DAC_Interpolation_Mode02 1 \
  CONFIG.DAC_Interpolation_Mode03 1 \
  CONFIG.DAC_Interpolation_Mode10 1 \
  CONFIG.DAC_Interpolation_Mode11 1 \
  CONFIG.DAC_Interpolation_Mode12 1 \
  CONFIG.DAC_Interpolation_Mode13 1 \
  CONFIG.DAC_Mixer_Type00 0 \
  CONFIG.DAC_Mixer_Type01 0 \
  CONFIG.DAC_Mixer_Type02 0 \
  CONFIG.DAC_Mixer_Type03 0 \
  CONFIG.DAC_Mixer_Type10 0 \
  CONFIG.DAC_Mixer_Type11 0 \
  CONFIG.DAC_Mixer_Type12 0 \
  CONFIG.DAC_Mixer_Type13 0 \
  CONFIG.DAC_Slice00_Enable true \
  CONFIG.DAC_Slice01_Enable true \
  CONFIG.DAC_Slice02_Enable true \
  CONFIG.DAC_Slice03_Enable true \
  CONFIG.DAC_Slice10_Enable true \
  CONFIG.DAC_Slice11_Enable true \
  CONFIG.DAC_Slice12_Enable true \
  CONFIG.DAC_Slice13_Enable true \
] [get_bd_cells usp_rf_data_converter_0]
create_bd_cell -type ip -vlnv pi-rad.io:piradip:axis_sample_buffer_in:1.0 axis_sample_buffer_in_0
set_property -dict {CONFIG.STREAM_IN_WIDTH 128} [get_bd_cells axis_sample_buffer_in_0]
create_bd_cell -type ip -vlnv pi-rad.io:piradip:axis_sample_buffer_in:1.0 axis_sample_buffer_in_1
set_property -dict {CONFIG.STREAM_IN_WIDTH 128} [get_bd_cells axis_sample_buffer_in_1]
create_bd_cell -type ip -vlnv pi-rad.io:piradip:axis_sample_buffer_in:1.0 axis_sample_buffer_in_2
set_property -dict {CONFIG.STREAM_IN_WIDTH 128} [get_bd_cells axis_sample_buffer_in_2]
create_bd_cell -type ip -vlnv pi-rad.io:piradip:axis_sample_buffer_in:1.0 axis_sample_buffer_in_3
set_property -dict {CONFIG.STREAM_IN_WIDTH 128} [get_bd_cells axis_sample_buffer_in_3]
create_bd_cell -type ip -vlnv pi-rad.io:piradip:axis_sample_buffer_in:1.0 axis_sample_buffer_in_4
set_property -dict {CONFIG.STREAM_IN_WIDTH 128} [get_bd_cells axis_sample_buffer_in_4]
create_bd_cell -type ip -vlnv pi-rad.io:piradip:axis_sample_buffer_in:1.0 axis_sample_buffer_in_5
set_property -dict {CONFIG.STREAM_IN_WIDTH 128} [get_bd_cells axis_sample_buffer_in_5]
create_bd_cell -type ip -vlnv pi-rad.io:piradip:axis_sample_buffer_in:1.0 axis_sample_buffer_in_6
set_property -dict {CONFIG.STREAM_IN_WIDTH 128} [get_bd_cells axis_sample_buffer_in_6]
create_bd_cell -type ip -vlnv pi-rad.io:piradip:axis_sample_buffer_in:1.0 axis_sample_buffer_in_7
set_property -dict {CONFIG.STREAM_IN_WIDTH 128} [get_bd_cells axis_sample_buffer_in_7]
create_bd_cell -type ip -vlnv pi-rad.io:piradip:piradip_trigger_unit:1.0 piradip_trigger_unit_0
create_bd_cell -type ip -vlnv xilinx.com:ip:xlslice:1.0 xlslice_0
create_bd_cell -type ip -vlnv xilinx.com:ip:xlslice:1.0 xlslice_1
set_property -dict {CONFIG.DIN_FROM 1 CONFIG.DIN_TO 1 CONFIG.DOUT_WIDTH 1} [get_bd_cells xlslice_1]
create_bd_cell -type ip -vlnv xilinx.com:ip:xlslice:1.0 xlslice_2
set_property -dict {CONFIG.DIN_FROM 2 CONFIG.DIN_TO 2 CONFIG.DOUT_WIDTH 1} [get_bd_cells xlslice_2]
create_bd_cell -type ip -vlnv xilinx.com:ip:xlslice:1.0 xlslice_3
set_property -dict {CONFIG.DIN_FROM 3 CONFIG.DIN_TO 3 CONFIG.DOUT_WIDTH 1} [get_bd_cells xlslice_3]
create_bd_cell -type ip -vlnv xilinx.com:ip:xlslice:1.0 xlslice_4
set_property -dict {CONFIG.DIN_FROM 4 CONFIG.DIN_TO 4 CONFIG.DOUT_WIDTH 1} [get_bd_cells xlslice_4]
create_bd_cell -type ip -vlnv xilinx.com:ip:xlslice:1.0 xlslice_5
set_property -dict {CONFIG.DIN_FROM 5 CONFIG.DIN_TO 5 CONFIG.DOUT_WIDTH 1} [get_bd_cells xlslice_5]
create_bd_cell -type ip -vlnv xilinx.com:ip:xlslice:1.0 xlslice_6
set_property -dict {CONFIG.DIN_FROM 6 CONFIG.DIN_TO 6 CONFIG.DOUT_WIDTH 1} [get_bd_cells xlslice_6]
create_bd_cell -type ip -vlnv xilinx.com:ip:xlslice:1.0 xlslice_7
set_property -dict {CONFIG.DIN_FROM 7 CONFIG.DIN_TO 7 CONFIG.DOUT_WIDTH 1} [get_bd_cells xlslice_7]
create_bd_cell -type ip -vlnv xilinx.com:ip:xlslice:1.0 xlslice_8
set_property -dict {CONFIG.DIN_FROM 8 CONFIG.DIN_TO 8 CONFIG.DOUT_WIDTH 1} [get_bd_cells xlslice_8]
create_bd_cell -type ip -vlnv xilinx.com:ip:xlslice:1.0 xlslice_9
set_property -dict {CONFIG.DIN_FROM 9 CONFIG.DIN_TO 9 CONFIG.DOUT_WIDTH 1} [get_bd_cells xlslice_9]
create_bd_cell -type ip -vlnv xilinx.com:ip:xlslice:1.0 xlslice_10
set_property -dict {CONFIG.DIN_FROM 10 CONFIG.DIN_TO 10 CONFIG.DOUT_WIDTH 1} [get_bd_cells xlslice_10]
create_bd_cell -type ip -vlnv xilinx.com:ip:xlslice:1.0 xlslice_11
set_property -dict {CONFIG.DIN_FROM 11 CONFIG.DIN_TO 11 CONFIG.DOUT_WIDTH 1} [get_bd_cells xlslice_11]
create_bd_cell -type ip -vlnv xilinx.com:ip:xlslice:1.0 xlslice_12
set_property -dict {CONFIG.DIN_FROM 12 CONFIG.DIN_TO 12 CONFIG.DOUT_WIDTH 1} [get_bd_cells xlslice_12]
create_bd_cell -type ip -vlnv xilinx.com:ip:xlslice:1.0 xlslice_13
set_property -dict {CONFIG.DIN_FROM 13 CONFIG.DIN_TO 13 CONFIG.DOUT_WIDTH 1} [get_bd_cells xlslice_13]
create_bd_cell -type ip -vlnv xilinx.com:ip:xlslice:1.0 xlslice_14
set_property -dict {CONFIG.DIN_FROM 14 CONFIG.DIN_TO 14 CONFIG.DOUT_WIDTH 1} [get_bd_cells xlslice_14]
create_bd_cell -type ip -vlnv xilinx.com:ip:xlslice:1.0 xlslice_15
set_property -dict {CONFIG.DIN_FROM 15 CONFIG.DIN_TO 15 CONFIG.DOUT_WIDTH 1} [get_bd_cells xlslice_15]

# ---- connections ----

current_bd_instance /rf_data_subsystem
connect_bd_intf_net [get_bd_intf_pins S00_AXI] [get_bd_intf_pins axi_interconnect_0/S00_AXI]
connect_bd_intf_net -intf_net adc0_clk_0_1 [get_bd_intf_pins adc0_clk_0] [get_bd_intf_pins usp_rf_data_converter_0/adc0_clk]
connect_bd_intf_net -intf_net adc1_clk_0_1 [get_bd_intf_pins adc1_clk_0] [get_bd_intf_pins usp_rf_data_converter_0/adc1_clk]
connect_bd_intf_net -intf_net adc2_clk_0_1 [get_bd_intf_pins adc2_clk_0] [get_bd_intf_pins usp_rf_data_converter_0/adc2_clk]
connect_bd_intf_net -intf_net adc3_clk_0_1 [get_bd_intf_pins adc3_clk_0] [get_bd_intf_pins usp_rf_data_converter_0/adc3_clk]
connect_bd_intf_net [get_bd_intf_pins axi_interconnect_0/M00_AXI] [get_bd_intf_pins axis_sample_buffer_o_0/AXILITE]
connect_bd_intf_net [get_bd_intf_pins axi_interconnect_0/M01_AXI] [get_bd_intf_pins axis_sample_buffer_o_0/AXIMM]
connect_bd_intf_net [get_bd_intf_pins axi_interconnect_0/M02_AXI] [get_bd_intf_pins axis_sample_buffer_o_1/AXILITE]
connect_bd_intf_net [get_bd_intf_pins axi_interconnect_0/M03_AXI] [get_bd_intf_pins axis_sample_buffer_o_1/AXIMM]
connect_bd_intf_net [get_bd_intf_pins axi_interconnect_0/M04_AXI] [get_bd_intf_pins axis_sample_buffer_o_2/AXILITE]
connect_bd_intf_net [get_bd_intf_pins axi_interconnect_0/M05_AXI] [get_bd_intf_pins axis_sample_buffer_o_2/AXIMM]
connect_bd_intf_net [get_bd_intf_pins axi_interconnect_0/M06_AXI] [get_bd_intf_pins axis_sample_buffer_o_3/AXILITE]
connect_bd_intf_net [get_bd_intf_pins axi_interconnect_0/M07_AXI] [get_bd_intf_pins axis_sample_buffer_o_3/AXIMM]
connect_bd_intf_net [get_bd_intf_pins axi_interconnect_0/M08_AXI] [get_bd_intf_pins axis_sample_buffer_o_4/AXILITE]
connect_bd_intf_net [get_bd_intf_pins axi_interconnect_0/M09_AXI] [get_bd_intf_pins axis_sample_buffer_o_4/AXIMM]
connect_bd_intf_net [get_bd_intf_pins axi_interconnect_0/M10_AXI] [get_bd_intf_pins axis_sample_buffer_o_5/AXILITE]
connect_bd_intf_net [get_bd_intf_pins axi_interconnect_0/M11_AXI] [get_bd_intf_pins axis_sample_buffer_o_5/AXIMM]
connect_bd_intf_net [get_bd_intf_pins axi_interconnect_0/M12_AXI] [get_bd_intf_pins axis_sample_buffer_o_6/AXILITE]
connect_bd_intf_net [get_bd_intf_pins axi_interconnect_0/M13_AXI] [get_bd_intf_pins axis_sample_buffer_o_6/AXIMM]
connect_bd_intf_net [get_bd_intf_pins axi_interconnect_0/M14_AXI] [get_bd_intf_pins axis_sample_buffer_o_7/AXILITE]
connect_bd_intf_net [get_bd_intf_pins axi_interconnect_0/M15_AXI] [get_bd_intf_pins axis_sample_buffer_o_7/AXIMM]
connect_bd_intf_net [get_bd_intf_pins axi_interconnect_0/M16_AXI] [get_bd_intf_pins axis_sample_buffer_in_0/AXILITE]
connect_bd_intf_net [get_bd_intf_pins axis_sample_buffer_in_0/AXIMM] [get_bd_intf_pins axi_interconnect_0/M17_AXI]
connect_bd_intf_net [get_bd_intf_pins axi_interconnect_0/M18_AXI] [get_bd_intf_pins axis_sample_buffer_in_1/AXILITE]
connect_bd_intf_net [get_bd_intf_pins axis_sample_buffer_in_1/AXIMM] [get_bd_intf_pins axi_interconnect_0/M19_AXI]
connect_bd_intf_net [get_bd_intf_pins axi_interconnect_0/M20_AXI] [get_bd_intf_pins axis_sample_buffer_in_2/AXILITE]
connect_bd_intf_net [get_bd_intf_pins axis_sample_buffer_in_2/AXIMM] [get_bd_intf_pins axi_interconnect_0/M21_AXI]
connect_bd_intf_net [get_bd_intf_pins axi_interconnect_0/M22_AXI] [get_bd_intf_pins axis_sample_buffer_in_3/AXILITE]
connect_bd_intf_net [get_bd_intf_pins axis_sample_buffer_in_3/AXIMM] [get_bd_intf_pins axi_interconnect_0/M23_AXI]
connect_bd_intf_net [get_bd_intf_pins axi_interconnect_0/M24_AXI] [get_bd_intf_pins axis_sample_buffer_in_4/AXILITE]
connect_bd_intf_net [get_bd_intf_pins axi_interconnect_0/M25_AXI] [get_bd_intf_pins axis_sample_buffer_in_4/AXIMM]
connect_bd_intf_net [get_bd_intf_pins axis_sample_buffer_in_5/AXILITE] [get_bd_intf_pins axi_interconnect_0/M26_AXI]
connect_bd_intf_net [get_bd_intf_pins axi_interconnect_0/M27_AXI] [get_bd_intf_pins axis_sample_buffer_in_5/AXIMM]
connect_bd_intf_net [get_bd_intf_pins axis_sample_buffer_in_6/AXILITE] [get_bd_intf_pins axi_interconnect_0/M28_AXI]
connect_bd_intf_net [get_bd_intf_pins axi_interconnect_0/M29_AXI] [get_bd_intf_pins axis_sample_buffer_in_6/AXIMM]
connect_bd_intf_net [get_bd_intf_pins axi_interconnect_0/M30_AXI] [get_bd_intf_pins axis_sample_buffer_in_7/AXILITE]
connect_bd_intf_net [get_bd_intf_pins axi_interconnect_0/M31_AXI] [get_bd_intf_pins axis_sample_buffer_in_7/AXIMM]
connect_bd_intf_net [get_bd_intf_pins axi_interconnect_0/M32_AXI] [get_bd_intf_pins piradip_trigger_unit_0/AXILITE]
connect_bd_intf_net [get_bd_intf_pins axis_sample_buffer_o_0/STREAM_OUT] [get_bd_intf_pins usp_rf_data_converter_0/s00_axis]
connect_bd_intf_net [get_bd_intf_pins axis_sample_buffer_o_1/STREAM_OUT] [get_bd_intf_pins usp_rf_data_converter_0/s01_axis]
connect_bd_intf_net [get_bd_intf_pins axis_sample_buffer_o_2/STREAM_OUT] [get_bd_intf_pins usp_rf_data_converter_0/s02_axis]
connect_bd_intf_net [get_bd_intf_pins axis_sample_buffer_o_3/STREAM_OUT] [get_bd_intf_pins usp_rf_data_converter_0/s03_axis]
connect_bd_intf_net [get_bd_intf_pins axis_sample_buffer_o_4/STREAM_OUT] [get_bd_intf_pins usp_rf_data_converter_0/s10_axis]
connect_bd_intf_net [get_bd_intf_pins axis_sample_buffer_o_5/STREAM_OUT] [get_bd_intf_pins usp_rf_data_converter_0/s11_axis]
connect_bd_intf_net [get_bd_intf_pins axis_sample_buffer_o_6/STREAM_OUT] [get_bd_intf_pins usp_rf_data_converter_0/s12_axis]
connect_bd_intf_net [get_bd_intf_pins axis_sample_buffer_o_7/STREAM_OUT] [get_bd_intf_pins usp_rf_data_converter_0/s13_axis]
connect_bd_intf_net -intf_net dac0_clk_0_1 [get_bd_intf_pins dac0_clk_0] [get_bd_intf_pins usp_rf_data_converter_0/dac0_clk]
connect_bd_intf_net -intf_net dac1_clk_0_1 [get_bd_intf_pins dac1_clk_0] [get_bd_intf_pins usp_rf_data_converter_0/dac1_clk]
connect_bd_intf_net [get_bd_intf_pins s_axi] [get_bd_intf_pins usp_rf_data_converter_0/s_axi]
connect_bd_intf_net -intf_net sysref_in_0_1 [get_bd_intf_pins sysref_in_0] [get_bd_intf_pins usp_rf_data_converter_0/sysref_in]
connect_bd_intf_net [get_bd_intf_pins usp_rf_data_converter_0/m00_axis] [get_bd_intf_pins axis_sample_buffer_in_0/STREAM_IN]
connect_bd_intf_net [get_bd_intf_pins axis_sample_buffer_in_1/STREAM_IN] [get_bd_intf_pins usp_rf_data_converter_0/m02_axis]
connect_bd_intf_net [get_bd_intf_pins usp_rf_data_converter_0/m10_axis] [get_bd_intf_pins axis_sample_buffer_in_2/STREAM_IN]
connect_bd_intf_net [get_bd_intf_pins axis_sample_buffer_in_3/STREAM_IN] [get_bd_intf_pins usp_rf_data_converter_0/m12_axis]
connect_bd_intf_net [get_bd_intf_pins usp_rf_data_converter_0/m20_axis] [get_bd_intf_pins axis_sample_buffer_in_4/STREAM_IN]
connect_bd_intf_net [get_bd_intf_pins axis_sample_buffer_in_5/STREAM_IN] [get_bd_intf_pins usp_rf_data_converter_0/m22_axis]
connect_bd_intf_net [get_bd_intf_pins usp_rf_data_converter_0/m30_axis] [get_bd_intf_pins axis_sample_buffer_in_6/STREAM_IN]
connect_bd_intf_net [get_bd_intf_pins axis_sample_buffer_in_7/STREAM_IN] [get_bd_intf_pins usp_rf_data_converter_0/m32_axis]
connect_bd_intf_net [get_bd_intf_pins vout00_0] [get_bd_intf_pins usp_rf_data_converter_0/vout00]
connect_bd_intf_net [get_bd_intf_pins vout01_0] [get_bd_intf_pins usp_rf_data_converter_0/vout01]
connect_bd_intf_net [get_bd_intf_pins vout02_0] [get_bd_intf_pins usp_rf_data_converter_0/vout02]
connect_bd_intf_net [get_bd_intf_pins vout03_0] [get_bd_intf_pins usp_rf_data_converter_0/vout03]
connect_bd_intf_net [get_bd_intf_pins vout10_0] [get_bd_intf_pins usp_rf_data_converter_0/vout10]
connect_bd_intf_net [get_bd_intf_pins vout11_0] [get_bd_intf_pins usp_rf_data_converter_0/vout11]
connect_bd_intf_net [get_bd_intf_pins vout12_0] [get_bd_intf_pins usp_rf_data_converter_0/vout12]
connect_bd_intf_net [get_bd_intf_pins vout13_0] [get_bd_intf_pins usp_rf_data_converter_0/vout13]
connect_bd_intf_net -intf_net vin0_01_0_1 [get_bd_intf_pins vin0_01_0] [get_bd_intf_pins usp_rf_data_converter_0/vin0_01]
connect_bd_intf_net -intf_net vin0_23_0_1 [get_bd_intf_pins vin0_23_0] [get_bd_intf_pins usp_rf_data_converter_0/vin0_23]
connect_bd_intf_net -intf_net vin1_01_0_1 [get_bd_intf_pins vin1_01_0] [get_bd_intf_pins usp_rf_data_converter_0/vin1_01]
connect_bd_intf_net -intf_net vin1_23_0_1 [get_bd_intf_pins vin1_23_0] [get_bd_intf_pins usp_rf_data_converter_0/vin1_23]
connect_bd_intf_net -intf_net vin2_01_0_1 [get_bd_intf_pins vin2_01_0] [get_bd_intf_pins usp_rf_data_converter_0/vin2_01]
connect_bd_intf_net -intf_net vin2_23_0_1 [get_bd_intf_pins vin2_23_0] [get_bd_intf_pins usp_rf_data_converter_0/vin2_23]
connect_bd_intf_net -intf_net vin3_01_0_1 [get_bd_intf_pins vin3_01_0] [get_bd_intf_pins usp_rf_data_converter_0/vin3_01]
connect_bd_intf_net -intf_net vin3_23_0_1 [get_bd_intf_pins vin3_23_0] [get_bd_intf_pins usp_rf_data_converter_0/vin3_23]
connect_bd_net [get_bd_pins s1_axis_aresetn] \
  [get_bd_pins axis_sample_buffer_o_0/stream_out_resetn] [get_bd_pins axis_sample_buffer_o_1/stream_out_resetn] \
  [get_bd_pins axis_sample_buffer_o_2/stream_out_resetn] [get_bd_pins axis_sample_buffer_o_3/stream_out_resetn] \
  [get_bd_pins axis_sample_buffer_o_4/stream_out_resetn] [get_bd_pins axis_sample_buffer_o_5/stream_out_resetn] \
  [get_bd_pins axis_sample_buffer_o_6/stream_out_resetn] [get_bd_pins axis_sample_buffer_o_7/stream_out_resetn] \
  [get_bd_pins usp_rf_data_converter_0/s0_axis_aresetn] [get_bd_pins usp_rf_data_converter_0/s1_axis_aresetn]
connect_bd_net -net clk_wiz_0_clk_out1 [get_bd_pins s0_axis_aclk] \
  [get_bd_pins axis_sample_buffer_o_0/stream_out_clk] [get_bd_pins axis_sample_buffer_o_1/stream_out_clk] \
  [get_bd_pins axis_sample_buffer_o_2/stream_out_clk] [get_bd_pins axis_sample_buffer_o_3/stream_out_clk] \
  [get_bd_pins axis_sample_buffer_o_4/stream_out_clk] [get_bd_pins axis_sample_buffer_o_5/stream_out_clk] \
  [get_bd_pins axis_sample_buffer_o_6/stream_out_clk] [get_bd_pins axis_sample_buffer_o_7/stream_out_clk] \
  [get_bd_pins usp_rf_data_converter_0/s0_axis_aclk] [get_bd_pins usp_rf_data_converter_0/s1_axis_aclk]
connect_bd_net -net clk_wiz_0_clk_out2 [get_bd_pins m1_axis_aclk] \
  [get_bd_pins usp_rf_data_converter_0/m0_axis_aclk] [get_bd_pins usp_rf_data_converter_0/m1_axis_aclk] \
  [get_bd_pins usp_rf_data_converter_0/m2_axis_aclk] [get_bd_pins usp_rf_data_converter_0/m3_axis_aclk] \
  [get_bd_pins axis_sample_buffer_in_0/stream_in_clk] [get_bd_pins axis_sample_buffer_in_1/stream_in_clk] \
  [get_bd_pins axis_sample_buffer_in_2/stream_in_clk] [get_bd_pins axis_sample_buffer_in_3/stream_in_clk] \
  [get_bd_pins axis_sample_buffer_in_4/stream_in_clk] [get_bd_pins axis_sample_buffer_in_5/stream_in_clk] \
  [get_bd_pins axis_sample_buffer_in_6/stream_in_clk] [get_bd_pins axis_sample_buffer_in_7/stream_in_clk]
connect_bd_net [get_bd_pins piradip_trigger_unit_0/triggers] \
  [get_bd_pins xlslice_0/Din] [get_bd_pins xlslice_1/Din] [get_bd_pins xlslice_2/Din] [get_bd_pins xlslice_3/Din] \
  [get_bd_pins xlslice_4/Din] [get_bd_pins xlslice_5/Din] [get_bd_pins xlslice_6/Din] [get_bd_pins xlslice_7/Din] \
  [get_bd_pins xlslice_8/Din] [get_bd_pins xlslice_9/Din] [get_bd_pins xlslice_10/Din] [get_bd_pins xlslice_11/Din] \
  [get_bd_pins xlslice_12/Din] [get_bd_pins xlslice_13/Din] [get_bd_pins xlslice_14/Din] [get_bd_pins xlslice_15/Din]
connect_bd_net -net proc_sys_reset_1_interconnect_aresetn [get_bd_pins m1_axis_aresetn] \
  [get_bd_pins usp_rf_data_converter_0/m0_axis_aresetn] [get_bd_pins usp_rf_data_converter_0/m1_axis_aresetn] \
  [get_bd_pins usp_rf_data_converter_0/m2_axis_aresetn] [get_bd_pins usp_rf_data_converter_0/m3_axis_aresetn] \
  [get_bd_pins axis_sample_buffer_in_0/stream_in_resetn] [get_bd_pins axis_sample_buffer_in_1/stream_in_resetn] \
  [get_bd_pins axis_sample_buffer_in_2/stream_in_resetn] [get_bd_pins axis_sample_buffer_in_3/stream_in_resetn] \
  [get_bd_pins axis_sample_buffer_in_4/stream_in_resetn] [get_bd_pins axis_sample_buffer_in_5/stream_in_resetn] \
  [get_bd_pins axis_sample_buffer_in_6/stream_in_resetn] [get_bd_pins axis_sample_buffer_in_7/stream_in_resetn]
connect_bd_net -net rst_ps8_0_333M_peripheral_aresetn [get_bd_pins s_axi_aresetn] \
  [get_bd_pins axi_interconnect_0/ARESETN] [get_bd_pins axi_interconnect_0/M00_ARESETN] \
  [get_bd_pins axi_interconnect_0/M01_ARESETN] [get_bd_pins axi_interconnect_0/M02_ARESETN] \
  [get_bd_pins axi_interconnect_0/M03_ARESETN] [get_bd_pins axi_interconnect_0/M04_ARESETN] \
  [get_bd_pins axi_interconnect_0/M05_ARESETN] [get_bd_pins axi_interconnect_0/M06_ARESETN] \
  [get_bd_pins axi_interconnect_0/M07_ARESETN] [get_bd_pins axi_interconnect_0/M08_ARESETN] \
  [get_bd_pins axi_interconnect_0/M09_ARESETN] [get_bd_pins axi_interconnect_0/M10_ARESETN] \
  [get_bd_pins axi_interconnect_0/M11_ARESETN] [get_bd_pins axi_interconnect_0/M12_ARESETN] \
  [get_bd_pins axi_interconnect_0/M13_ARESETN] [get_bd_pins axi_interconnect_0/M14_ARESETN] \
  [get_bd_pins axi_interconnect_0/M15_ARESETN] [get_bd_pins axi_interconnect_0/S00_ARESETN] \
  [get_bd_pins axis_sample_buffer_o_0/axilite_resetn] [get_bd_pins axis_sample_buffer_o_0/aximm_resetn] \
  [get_bd_pins axis_sample_buffer_o_1/axilite_resetn] [get_bd_pins axis_sample_buffer_o_1/aximm_resetn] \
  [get_bd_pins axis_sample_buffer_o_2/axilite_resetn] [get_bd_pins axis_sample_buffer_o_2/aximm_resetn] \
  [get_bd_pins axis_sample_buffer_o_3/axilite_resetn] [get_bd_pins axis_sample_buffer_o_3/aximm_resetn] \
  [get_bd_pins axis_sample_buffer_o_4/axilite_resetn] [get_bd_pins axis_sample_buffer_o_4/aximm_resetn] \
  [get_bd_pins axis_sample_buffer_o_5/axilite_resetn] [get_bd_pins axis_sample_buffer_o_5/aximm_resetn] \
  [get_bd_pins axis_sample_buffer_o_6/axilite_resetn] [get_bd_pins axis_sample_buffer_o_6/aximm_resetn] \
  [get_bd_pins axis_sample_buffer_o_7/axilite_resetn] [get_bd_pins axis_sample_buffer_o_7/aximm_resetn] \
  [get_bd_pins usp_rf_data_converter_0/s_axi_aresetn] [get_bd_pins axi_interconnect_0/M16_ARESETN] \
  [get_bd_pins axis_sample_buffer_in_0/axilite_resetn] [get_bd_pins axi_interconnect_0/M17_ARESETN] \
  [get_bd_pins axis_sample_buffer_in_0/aximm_resetn] [get_bd_pins axi_interconnect_0/M18_ARESETN] \
  [get_bd_pins axis_sample_buffer_in_1/axilite_resetn] [get_bd_pins axi_interconnect_0/M19_ARESETN] \
  [get_bd_pins axis_sample_buffer_in_1/aximm_resetn] [get_bd_pins axi_interconnect_0/M20_ARESETN] \
  [get_bd_pins axis_sample_buffer_in_2/axilite_resetn] [get_bd_pins axi_interconnect_0/M21_ARESETN] \
  [get_bd_pins axis_sample_buffer_in_2/aximm_resetn] [get_bd_pins axi_interconnect_0/M22_ARESETN] \
  [get_bd_pins axis_sample_buffer_in_3/axilite_resetn] [get_bd_pins axi_interconnect_0/M23_ARESETN] \
  [get_bd_pins axis_sample_buffer_in_3/aximm_resetn] [get_bd_pins axi_interconnect_0/M24_ARESETN] \
  [get_bd_pins axis_sample_buffer_in_4/axilite_resetn] [get_bd_pins axi_interconnect_0/M25_ARESETN] \
  [get_bd_pins axis_sample_buffer_in_4/aximm_resetn] [get_bd_pins axi_interconnect_0/M26_ARESETN] \
  [get_bd_pins axis_sample_buffer_in_5/axilite_resetn] [get_bd_pins axi_interconnect_0/M27_ARESETN] \
  [get_bd_pins axis_sample_buffer_in_5/aximm_resetn] [get_bd_pins axi_interconnect_0/M28_ARESETN] \
  [get_bd_pins axis_sample_buffer_in_6/axilite_resetn] [get_bd_pins axi_interconnect_0/M29_ARESETN] \
  [get_bd_pins axis_sample_buffer_in_6/aximm_resetn] [get_bd_pins axi_interconnect_0/M30_ARESETN] \
  [get_bd_pins axis_sample_buffer_in_7/axilite_resetn] [get_bd_pins axi_interconnect_0/M31_ARESETN] \
  [get_bd_pins axis_sample_buffer_in_7/aximm_resetn] [get_bd_pins axi_interconnect_0/M32_ARESETN] \
  [get_bd_pins piradip_trigger_unit_0/axilite_resetn]
connect_bd_net [get_bd_pins xlslice_0/Dout] [get_bd_pins axis_sample_buffer_o_0/trigger]
connect_bd_net [get_bd_pins xlslice_10/Dout] [get_bd_pins axis_sample_buffer_in_2/trigger]
connect_bd_net [get_bd_pins xlslice_11/Dout] [get_bd_pins axis_sample_buffer_in_3/trigger]
connect_bd_net [get_bd_pins xlslice_12/Dout] [get_bd_pins axis_sample_buffer_in_4/trigger]
connect_bd_net [get_bd_pins xlslice_13/Dout] [get_bd_pins axis_sample_buffer_in_5/trigger]
connect_bd_net [get_bd_pins xlslice_14/Dout] [get_bd_pins axis_sample_buffer_in_6/trigger]
connect_bd_net [get_bd_pins xlslice_15/Dout] [get_bd_pins axis_sample_buffer_in_7/trigger]
connect_bd_net [get_bd_pins xlslice_1/Dout] [get_bd_pins axis_sample_buffer_o_1/trigger]
connect_bd_net [get_bd_pins xlslice_2/Dout] [get_bd_pins axis_sample_buffer_o_2/trigger]
connect_bd_net [get_bd_pins xlslice_3/Dout] [get_bd_pins axis_sample_buffer_o_3/trigger]
connect_bd_net [get_bd_pins xlslice_4/Dout] [get_bd_pins axis_sample_buffer_o_5/trigger]
connect_bd_net [get_bd_pins xlslice_5/Dout] [get_bd_pins axis_sample_buffer_o_4/trigger]
connect_bd_net [get_bd_pins xlslice_6/Dout] [get_bd_pins axis_sample_buffer_o_6/trigger]
connect_bd_net [get_bd_pins xlslice_7/Dout] [get_bd_pins axis_sample_buffer_o_7/trigger]
connect_bd_net [get_bd_pins xlslice_8/Dout] [get_bd_pins axis_sample_buffer_in_0/trigger]
connect_bd_net [get_bd_pins xlslice_9/Dout] [get_bd_pins axis_sample_buffer_in_1/trigger]
connect_bd_net -net zynq_ultra_ps_e_0_pl_clk0 [get_bd_pins s_axi_aclk] \
  [get_bd_pins axi_interconnect_0/ACLK] [get_bd_pins axi_interconnect_0/M00_ACLK] [get_bd_pins axi_interconnect_0/M01_ACLK] \
  [get_bd_pins axi_interconnect_0/M02_ACLK] [get_bd_pins axi_interconnect_0/M03_ACLK] \
  [get_bd_pins axi_interconnect_0/M04_ACLK] [get_bd_pins axi_interconnect_0/M05_ACLK] \
  [get_bd_pins axi_interconnect_0/M06_ACLK] [get_bd_pins axi_interconnect_0/M07_ACLK] \
  [get_bd_pins axi_interconnect_0/M08_ACLK] [get_bd_pins axi_interconnect_0/M09_ACLK] \
  [get_bd_pins axi_interconnect_0/M10_ACLK] [get_bd_pins axi_interconnect_0/M11_ACLK] \
  [get_bd_pins axi_interconnect_0/M12_ACLK] [get_bd_pins axi_interconnect_0/M13_ACLK] \
  [get_bd_pins axi_interconnect_0/M14_ACLK] [get_bd_pins axi_interconnect_0/M15_ACLK] \
  [get_bd_pins axi_interconnect_0/S00_ACLK] [get_bd_pins axis_sample_buffer_o_0/axilite_clk] \
  [get_bd_pins axis_sample_buffer_o_0/aximm_clk] [get_bd_pins axis_sample_buffer_o_1/axilite_clk] \
  [get_bd_pins axis_sample_buffer_o_1/aximm_clk] [get_bd_pins axis_sample_buffer_o_2/axilite_clk] \
  [get_bd_pins axis_sample_buffer_o_2/aximm_clk] [get_bd_pins axis_sample_buffer_o_3/axilite_clk] \
  [get_bd_pins axis_sample_buffer_o_3/aximm_clk] [get_bd_pins axis_sample_buffer_o_4/axilite_clk] \
  [get_bd_pins axis_sample_buffer_o_4/aximm_clk] [get_bd_pins axis_sample_buffer_o_5/axilite_clk] \
  [get_bd_pins axis_sample_buffer_o_5/aximm_clk] [get_bd_pins axis_sample_buffer_o_6/axilite_clk] \
  [get_bd_pins axis_sample_buffer_o_6/aximm_clk] [get_bd_pins axis_sample_buffer_o_7/axilite_clk] \
  [get_bd_pins axis_sample_buffer_o_7/aximm_clk] [get_bd_pins usp_rf_data_converter_0/s_axi_aclk] \
  [get_bd_pins axi_interconnect_0/M16_ACLK] [get_bd_pins axis_sample_buffer_in_0/axilite_clk] \
  [get_bd_pins axi_interconnect_0/M17_ACLK] [get_bd_pins axis_sample_buffer_in_0/aximm_clk] \
  [get_bd_pins axi_interconnect_0/M18_ACLK] [get_bd_pins axis_sample_buffer_in_1/axilite_clk] \
  [get_bd_pins axi_interconnect_0/M19_ACLK] [get_bd_pins axis_sample_buffer_in_1/aximm_clk] \
  [get_bd_pins axi_interconnect_0/M20_ACLK] [get_bd_pins axis_sample_buffer_in_2/axilite_clk] \
  [get_bd_pins axi_interconnect_0/M21_ACLK] [get_bd_pins axis_sample_buffer_in_2/aximm_clk] \
  [get_bd_pins axi_interconnect_0/M22_ACLK] [get_bd_pins axis_sample_buffer_in_3/axilite_clk] \
  [get_bd_pins axi_interconnect_0/M23_ACLK] [get_bd_pins axis_sample_buffer_in_3/aximm_clk] \
  [get_bd_pins axi_interconnect_0/M24_ACLK] [get_bd_pins axis_sample_buffer_in_4/axilite_clk] \
  [get_bd_pins axi_interconnect_0/M25_ACLK] [get_bd_pins axis_sample_buffer_in_4/aximm_clk] \
  [get_bd_pins axi_interconnect_0/M26_ACLK] [get_bd_pins axis_sample_buffer_in_5/axilite_clk] \
  [get_bd_pins axi_interconnect_0/M27_ACLK] [get_bd_pins axis_sample_buffer_in_5/aximm_clk] \
  [get_bd_pins axi_interconnect_0/M28_ACLK] [get_bd_pins axis_sample_buffer_in_6/axilite_clk] \
  [get_bd_pins axi_interconnect_0/M29_ACLK] [get_bd_pins axis_sample_buffer_in_6/aximm_clk] \
  [get_bd_pins axi_interconnect_0/M30_ACLK] [get_bd_pins axis_sample_buffer_in_7/axilite_clk] \
  [get_bd_pins axi_interconnect_0/M31_ACLK] [get_bd_pins axis_sample_buffer_in_7/aximm_clk] \
  [get_bd_pins axi_interconnect_0/M32_ACLK] [get_bd_pins piradip_trigger_unit_0/axilite_clk]

current_bd_instance /
connect_bd_intf_net -intf_net adc0_clk_0_1 [get_bd_intf_ports adc0_clk_0] [get_bd_intf_pins rf_data_subsystem/adc0_clk_0]
connect_bd_intf_net -intf_net adc1_clk_0_1 [get_bd_intf_ports adc1_clk_0] [get_bd_intf_pins rf_data_subsystem/adc1_clk_0]
connect_bd_intf_net -intf_net adc2_clk_0_1 [get_bd_intf_ports adc2_clk_0] [get_bd_intf_pins rf_data_subsystem/adc2_clk_0]
connect_bd_intf_net -intf_net adc3_clk_0_1 [get_bd_intf_ports adc3_clk_0] [get_bd_intf_pins rf_data_subsystem/adc3_clk_0]
connect_bd_intf_net -intf_net dac0_clk_0_1 [get_bd_intf_ports dac0_clk_0] [get_bd_intf_pins rf_data_subsystem/dac0_clk_0]
connect_bd_intf_net -intf_net dac1_clk_0_1 [get_bd_intf_ports dac1_clk_0] [get_bd_intf_pins rf_data_subsystem/dac1_clk_0]
connect_bd_intf_net [get_bd_intf_pins ps8_0_axi_periph/M00_AXI] [get_bd_intf_pins rf_data_subsystem/s_axi]
connect_bd_intf_net [get_bd_intf_pins ps8_0_axi_periph/M01_AXI] [get_bd_intf_pins rf_data_subsystem/S00_AXI]
connect_bd_intf_net [get_bd_intf_pins piradspi_ip_0/CSR] [get_bd_intf_pins ps8_0_axi_periph/M02_AXI]
connect_bd_intf_net -intf_net sysref_in_0_1 [get_bd_intf_ports sysref_in_0] [get_bd_intf_pins rf_data_subsystem/sysref_in_0]
connect_bd_intf_net -intf_net usp_rf_data_converter_0_vout00 [get_bd_intf_ports vout00_0] [get_bd_intf_pins rf_data_subsystem/vout00_0]
connect_bd_intf_net -intf_net usp_rf_data_converter_0_vout01 [get_bd_intf_ports vout01_0] [get_bd_intf_pins rf_data_subsystem/vout01_0]
connect_bd_intf_net -intf_net usp_rf_data_converter_0_vout02 [get_bd_intf_ports vout02_0] [get_bd_intf_pins rf_data_subsystem/vout02_0]
connect_bd_intf_net -intf_net usp_rf_data_converter_0_vout03 [get_bd_intf_ports vout03_0] [get_bd_intf_pins rf_data_subsystem/vout03_0]
connect_bd_intf_net -intf_net usp_rf_data_converter_0_vout10 [get_bd_intf_ports vout10_0] [get_bd_intf_pins rf_data_subsystem/vout10_0]
connect_bd_intf_net -intf_net usp_rf_data_converter_0_vout11 [get_bd_intf_ports vout11_0] [get_bd_intf_pins rf_data_subsystem/vout11_0]
connect_bd_intf_net -intf_net usp_rf_data_converter_0_vout12 [get_bd_intf_ports vout12_0] [get_bd_intf_pins rf_data_subsystem/vout12_0]
connect_bd_intf_net -intf_net usp_rf_data_converter_0_vout13 [get_bd_intf_ports vout13_0] [get_bd_intf_pins rf_data_subsystem/vout13_0]
connect_bd_intf_net -intf_net vin0_01_0_1 [get_bd_intf_ports vin0_01_0] [get_bd_intf_pins rf_data_subsystem/vin0_01_0]
connect_bd_intf_net -intf_net vin0_23_0_1 [get_bd_intf_ports vin0_23_0] [get_bd_intf_pins rf_data_subsystem/vin0_23_0]
connect_bd_intf_net -intf_net vin1_01_0_1 [get_bd_intf_ports vin1_01_0] [get_bd_intf_pins rf_data_subsystem/vin1_01_0]
connect_bd_intf_net -intf_net vin1_23_0_1 [get_bd_intf_ports vin1_23_0] [get_bd_intf_pins rf_data_subsystem/vin1_23_0]
connect_bd_intf_net -intf_net vin2_01_0_1 [get_bd_intf_ports vin2_01_0] [get_bd_intf_pins rf_data_subsystem/vin2_01_0]
connect_bd_intf_net -intf_net vin2_23_0_1 [get_bd_intf_ports vin2_23_0] [get_bd_intf_pins rf_data_subsystem/vin2_23_0]
connect_bd_intf_net -intf_net vin3_01_0_1 [get_bd_intf_ports vin3_01_0] [get_bd_intf_pins rf_data_subsystem/vin3_01_0]
connect_bd_intf_net -intf_net vin3_23_0_1 [get_bd_intf_ports vin3_23_0] [get_bd_intf_pins rf_data_subsystem/vin3_23_0]
connect_bd_intf_net [get_bd_intf_pins ps8_0_axi_periph/S00_AXI] [get_bd_intf_pins zynq_ultra_ps_e_0/M_AXI_HPM0_FPD]
connect_bd_net [get_bd_pins proc_sys_reset_0/peripheral_aresetn] [get_bd_pins rf_data_subsystem/s1_axis_aresetn]
connect_bd_net [get_bd_pins clk_wiz_0/clk_out1] [get_bd_pins proc_sys_reset_0/slowest_sync_clk] [get_bd_pins rf_data_subsystem/s0_axis_aclk]
connect_bd_net [get_bd_pins clk_wiz_0/clk_out2] [get_bd_pins proc_sys_reset_1/slowest_sync_clk] [get_bd_pins rf_data_subsystem/m1_axis_aclk]
connect_bd_net -net miso_0_1 [get_bd_ports miso_0] [get_bd_pins piradspi_ip_0/miso]
connect_bd_net [get_bd_pins piradspi_ip_0/csn] [get_bd_ports csn_0]
connect_bd_net [get_bd_pins piradspi_ip_0/csn_active] [get_bd_ports csn_active_0]
connect_bd_net [get_bd_pins piradspi_ip_0/mosi] [get_bd_ports mosi_0]
connect_bd_net [get_bd_pins piradspi_ip_0/sclk] [get_bd_ports sclk_0]
connect_bd_net -net proc_sys_reset_1_interconnect_aresetn [get_bd_pins proc_sys_reset_1/peripheral_aresetn] \
  [get_bd_pins rf_data_subsystem/m1_axis_aresetn]
connect_bd_net [get_bd_pins rst_ps8_0_333M/bus_struct_reset] [get_bd_pins proc_sys_reset_1/aux_reset_in]
connect_bd_net [get_bd_pins rst_ps8_0_333M/peripheral_aresetn] \
  [get_bd_pins piradspi_ip_0/csr_resetn] [get_bd_pins ps8_0_axi_periph/ARESETN] [get_bd_pins ps8_0_axi_periph/M00_ARESETN] \
  [get_bd_pins ps8_0_axi_periph/M01_ARESETN] [get_bd_pins ps8_0_axi_periph/M02_ARESETN] \
  [get_bd_pins ps8_0_axi_periph/S00_ARESETN] [get_bd_pins rf_data_subsystem/s_axi_aresetn]
connect_bd_net [get_bd_pins rst_ps8_0_333M/peripheral_reset] [get_bd_pins clk_wiz_0/reset] [get_bd_pins proc_sys_reset_0/aux_reset_in]
connect_bd_net [get_bd_pins zynq_ultra_ps_e_0/pl_clk0] \
  [get_bd_pins piradspi_ip_0/csr_clk] [get_bd_pins ps8_0_axi_periph/ACLK] [get_bd_pins ps8_0_axi_periph/M00_ACLK] \
  [get_bd_pins ps8_0_axi_periph/M01_ACLK] [get_bd_pins ps8_0_axi_periph/M02_ACLK] [get_bd_pins ps8_0_axi_periph/S00_ACLK] \
  [get_bd_pins rf_data_subsystem/s_axi_aclk] [get_bd_pins rst_ps8_0_333M/slowest_sync_clk] \
  [get_bd_pins zynq_ultra_ps_e_0/maxihpm0_fpd_aclk]
connect_bd_net [get_bd_pins zynq_ultra_ps_e_0/pl_clk1] [get_bd_pins clk_wiz_0/clk_in1]
connect_bd_net [get_bd_pins zynq_ultra_ps_e_0/pl_resetn0] \
  [get_bd_pins proc_sys_reset_0/ext_reset_in] [get_bd_pins proc_sys_reset_1/ext_reset_in] \
  [get_bd_pins rst_ps8_0_333M/ext_reset_in]

# ---- address map ----
assign_bd_address -offset 0x00A0000000 -range 256K -target_address_space [get_bd_addr_spaces zynq_ultra_ps_e_0/Data] [get_bd_addr_segs rf_data_subsystem/usp_rf_data_converter_0/s_axi/Reg]

validate_bd_design
save_bd_design
